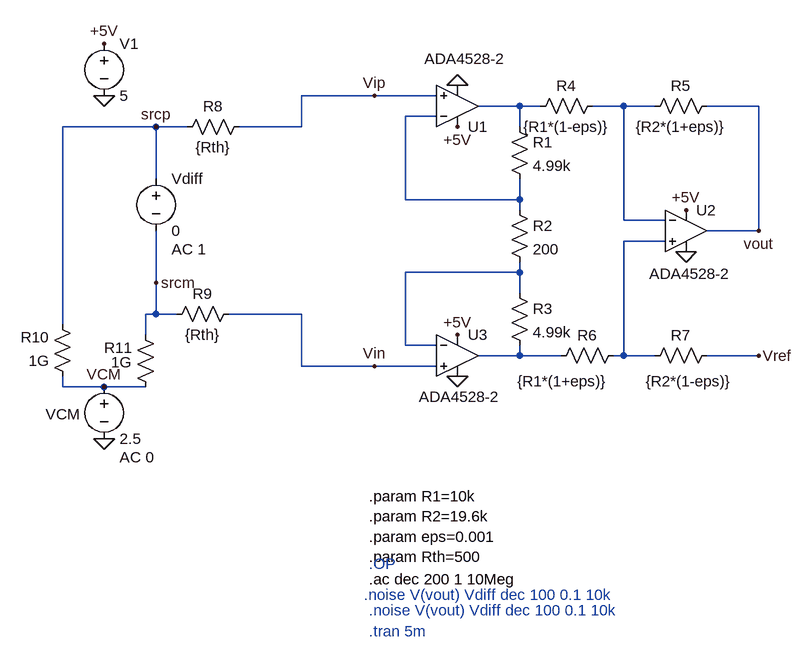
[diagram p0: schematic Draft3.asc]
Draft3.asc, the LTspice schematic file:
Version 4.1
SHEET 1 880 808
WIRE 128 -32 16 -32
WIRE 224 -32 128 -32
WIRE 352 -16 288 -16
WIRE 384 -16 352 -16
WIRE 512 -16 464 -16
WIRE 560 -16 512 -16
WIRE 720 -16 640 -16
WIRE 224 0 176 0
WIRE -208 16 -352 16
WIRE -160 16 -208 16
WIRE 16 16 16 -32
WIRE 16 16 -80 16
WIRE 352 16 352 -16
WIRE -208 96 -208 16
WIRE 176 128 176 0
WIRE 352 128 352 96
WIRE 352 128 176 128
WIRE 352 144 352 128
WIRE 512 160 512 -16
WIRE 576 160 512 160
WIRE 720 176 720 -16
WIRE 720 176 640 176
WIRE 576 192 512 192
WIRE 352 240 352 224
WIRE 352 240 176 240
WIRE -208 256 -208 176
WIRE 352 272 352 240
WIRE -208 304 -208 256
WIRE -208 304 -224 304
WIRE -176 304 -208 304
WIRE 16 304 -96 304
WIRE -352 320 -352 16
WIRE -224 336 -224 304
WIRE 176 352 176 240
WIRE 224 352 176 352
WIRE 352 368 352 352
WIRE 352 368 288 368
WIRE 416 368 352 368
WIRE 512 368 512 192
WIRE 512 368 496 368
WIRE 560 368 512 368
WIRE 720 368 640 368
WIRE 16 384 16 304
WIRE 128 384 16 384
WIRE 224 384 128 384
WIRE -352 416 -352 400
WIRE -288 416 -352 416
WIRE -224 416 -288 416
FLAG -288 -112 +5V
FLAG -288 -32 0
FLAG 256 16 +5V
FLAG 608 144 +5V
FLAG 256 336 +5V
FLAG 256 -48 0
FLAG 608 208 0
FLAG 256 400 0
FLAG 128 -32 Vip
FLAG 128 384 Vin
FLAG 720 176 vout
FLAG 720 368 Vref
FLAG -208 16 srcp
FLAG -208 256 srcm
FLAG -288 496 0
FLAG -288 416 VCM
SYMBOL voltage -288 -128 R0
WINDOW 123 0 0 Left 0
WINDOW 39 0 0 Left 0
SYMATTR InstName V1
SYMATTR Value 5
SYMBOL res 336 0 R0
SYMATTR InstName R1
SYMATTR Value 4.99k
SYMBOL res 336 128 R0
SYMATTR InstName R2
SYMATTR Value 200
SYMATTR SpiceLine tol=1
SYMBOL res 336 256 R0
SYMATTR InstName R3
SYMATTR Value 4.99k
SYMBOL res 480 -32 R90
WINDOW 0 0 56 VBottom 2
WINDOW 3 32 56 VTop 2
SYMATTR InstName R4
SYMATTR Value {R1*(1-eps)}
SYMBOL res 656 -32 R90
WINDOW 0 0 56 VBottom 2
WINDOW 3 32 56 VTop 2
SYMATTR InstName R5
SYMATTR Value {R2*(1+eps)}
SYMATTR SpiceLine tol=1
SYMBOL res 512 352 R90
WINDOW 0 0 56 VBottom 2
WINDOW 3 40 94 VTop 2
SYMATTR InstName R6
SYMATTR Value {R1*(1+eps)}
SYMBOL res 656 352 R90
WINDOW 0 0 56 VBottom 2
WINDOW 3 40 43 VTop 2
SYMATTR InstName R7
SYMATTR Value {R2*(1-eps)}
SYMATTR SpiceLine tol=1
SYMBOL OpAmps\\ADA4528-2 256 48 M180
WINDOW 3 -51 137 Left 2
SYMATTR InstName U1
SYMBOL OpAmps\\ADA4528-2 608 112 R0
WINDOW 3 -57 130 Left 2
SYMATTR InstName U2
SYMBOL OpAmps\\ADA4528-2 256 304 R0
WINDOW 3 -59 127 Left 2
SYMATTR InstName U3
SYMBOL voltage -208 80 R0
WINDOW 123 24 124 Left 2
WINDOW 39 0 0 Left 0
SYMATTR InstName Vdiff
SYMATTR Value 0
SYMATTR Value2 AC 1
SYMBOL res -64 0 R90
WINDOW 0 0 56 VBottom 2
WINDOW 3 32 56 VTop 2
SYMATTR InstName R8
SYMATTR Value {Rth}
SYMATTR SpiceLine tol=1
SYMBOL res -80 288 R90
WINDOW 0 0 56 VBottom 2
WINDOW 3 32 56 VTop 2
SYMATTR InstName R9
SYMATTR Value {Rth}
SYMATTR SpiceLine tol=1
SYMBOL voltage -288 400 R0
WINDOW 0 -90 58 Left 2
WINDOW 123 24 124 Left 2
WINDOW 39 0 0 Left 0
SYMATTR InstName VCM
SYMATTR Value2 AC 0
SYMATTR Value 2.5
SYMBOL res -336 416 R180
WINDOW 0 36 76 Left 2
WINDOW 3 36 40 Left 2
SYMATTR InstName R10
SYMATTR Value 1G
SYMATTR SpiceLine tol=1
SYMBOL res -208 432 R180
WINDOW 0 36 76 Left 2
WINDOW 3 37 54 Left 2
SYMATTR InstName R11
SYMATTR Value 1G
SYMATTR SpiceLine tol=1
TEXT 120 584 Left 2 !.param R1=10k\n.param R2=19.6k\n.param eps=0.001\n.param Rth=500
TEXT 120 688 Left 2 ;.OP
TEXT 120 712 Left 2 !.ac dec 200 1 10Meg
TEXT 112 736 Left 2 ;.noise V(vout) Vdiff dec 100 0.1 10k
TEXT 120 760 Left 2 ;.noise V(vout) Vdiff dec 100 0.1 10k
TEXT 120 792 Left 2 ;.tran 5m

The netlist it stands for:
* Draft3.asc
V1 +5V 0 5
R1 N001 N003 4.99k
R2 N003 N005 200 tol=1
R3 N005 N006 4.99k
R4 N002 N001 {R1*(1-eps)}
R5 vout N002 {R2*(1+eps)} tol=1
R6 N004 N006 {R1*(1+eps)}
R7 Vref N004 {R2*(1-eps)} tol=1
X§U1 Vip N003 +5V 0 N001 ADA4528-2  ; pins In+ In- V+ V- OUT
X§U2 N004 N002 +5V 0 vout ADA4528-2  ; pins In+ In- V+ V- OUT
X§U3 Vin N005 +5V 0 N006 ADA4528-2  ; pins In+ In- V+ V- OUT
Vdiff srcp srcm 0 AC 1
R8 Vip srcp {Rth} tol=1
R9 Vin srcm {Rth} tol=1
VCM VCM 0 2.5 AC 0
R10 VCM srcp 1G tol=1
R11 VCM srcm 1G tol=1
.param R1=10k
.param R2=19.6k
.param eps=0.001
.param Rth=500
* .OP
.ac dec 200 1 10Meg
* .noise V(vout) Vdiff dec 100 0.1 10k
* .noise V(vout) Vdiff dec 100 0.1 10k
* .tran 5m
.backanno
.end